# EAGLE design BMS (EAGLE 9.6.2)
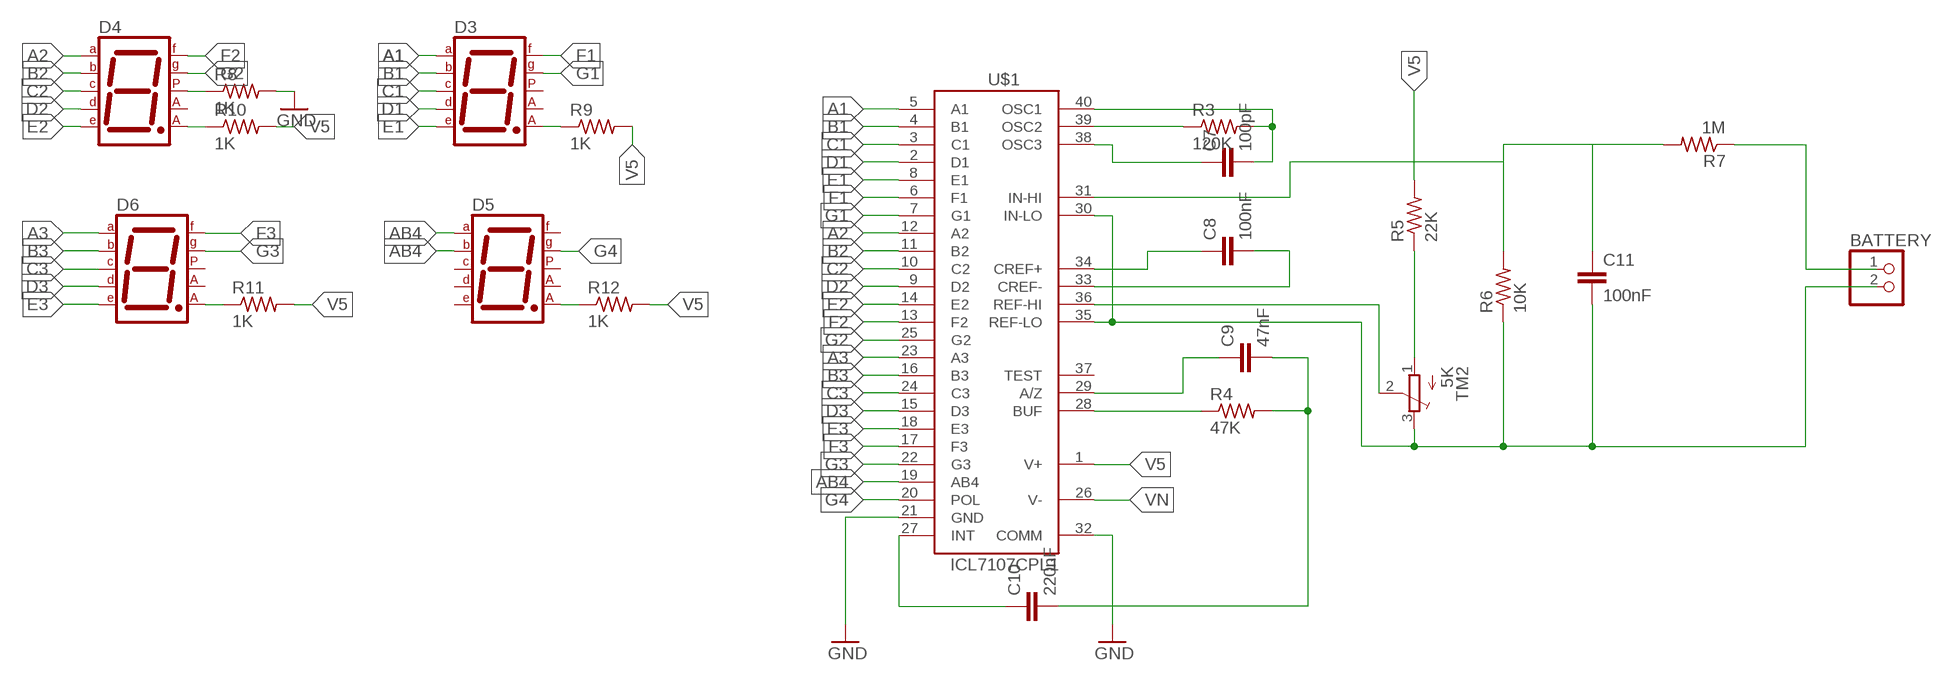
[diagram p0: schematic, sheet 1, part 1 of 2]
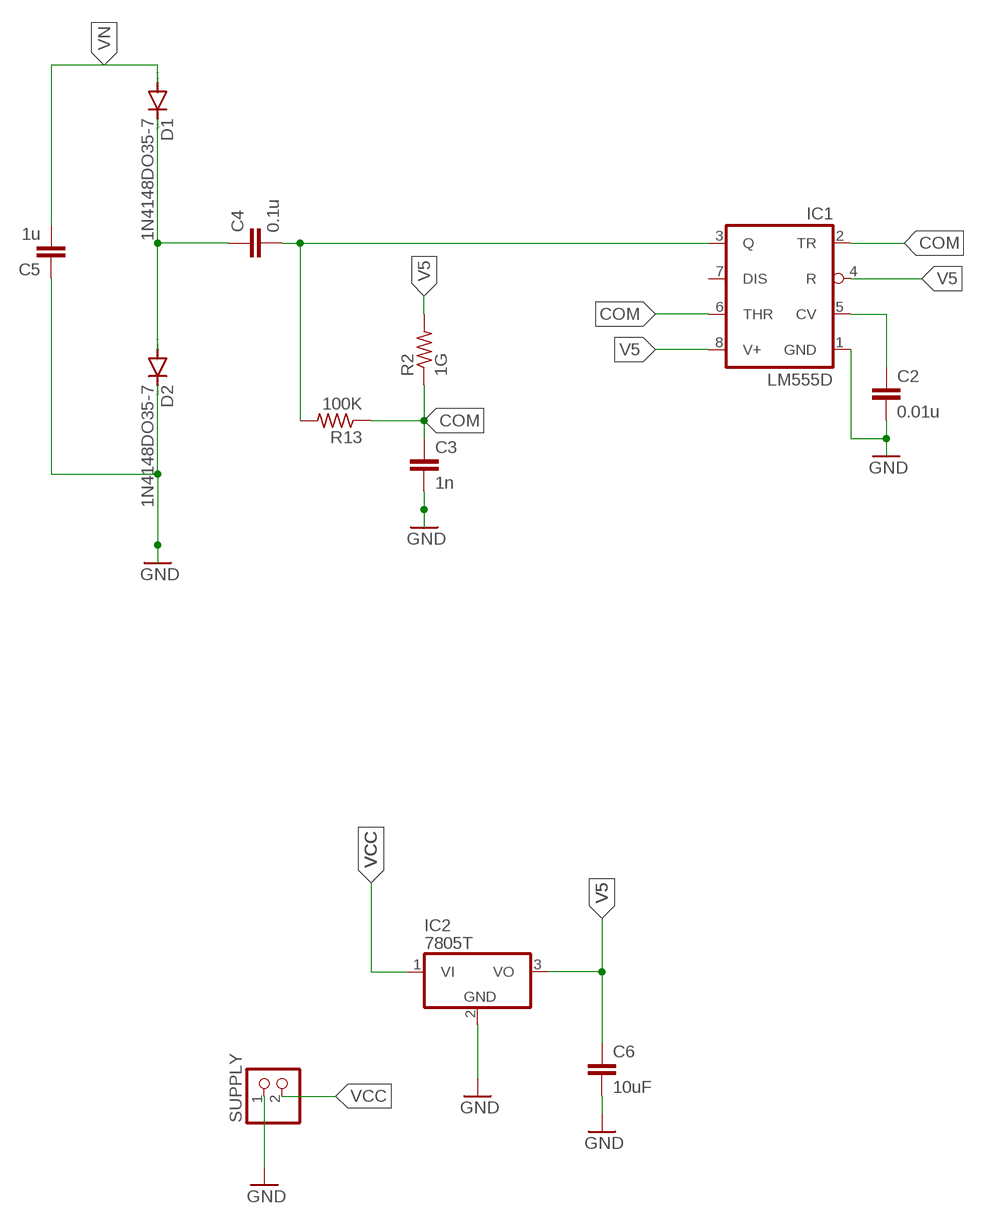
[diagram p1: schematic, sheet 1, part 2 of 2]

## Parts
BATTERY  PINHD-1X2  [1X02]
C2  0.01u  C-EU025-025X050  [C025-025X050]
C3  1n  C-EU025-025X050  [C025-025X050]
C4  0.1u  C-EU025-025X050  [C025-025X050]
C5  1u  C-EU025-025X050  [C025-025X050]
C6  10uF  C-EU025-025X050  [C025-025X050]
C7  100pF  C-EU025-025X050  [C025-025X050]
C8  100nF  C-EU025-025X050  [C025-025X050]
C9  47nF  C-EU025-025X050  [C025-025X050]
C10  220nF  C-EU025-025X050  [C025-025X050]
C11  100nF  C-EU025-025X050  [C025-025X050]
D1  1N4148DO35-7  [DO35-7]
D2  1N4148DO35-7  [DO35-7]
D3  7SEG-CA  [7SEG-13]
D4  7SEG-CA  [7SEG-13]
D5  7SEG-CA  [7SEG-13]
D6  7SEG-CA  [7SEG-13]
IC1  LM555D  [SO08]
IC2  7805T  [TO220H]
R2  1G  R-US_R0603  [R0603]
R3  120K  R-US_R0603  [R0603]
R4  47K  R-US_R0603  [R0603]
R5  22K  R-US_R0603  [R0603]
R6  10K  R-US_R0603  [R0603]
R7  1M  R-US_R0603  [R0603]
R8  1K  R-US_R0603  [R0603]
R9  1K  R-US_R0603  [R0603]
R10  1K  R-US_R0603  [R0603]
R11  1K  R-US_R0603  [R0603]
R12  1K  R-US_R0603  [R0603]
R13  100K  R-US_R0603  [R0603]
SUPPLY  PINHD-1X2  [1X02]
TM2  5K  TRIMPOTTC33X  [TC33X]
U$1  ICL7107CPL1  [DIL40]

## Nets
A1: D3.7(A) U$1.5(A1)
A2: D4.7(A) U$1.12(A2)
A3: D6.7(A) U$1.23(A3)
AB4: D5.6(B) D5.7(A) U$1.19(AB4)
B1: D3.6(B) U$1.4(B1)
B2: D4.6(B) U$1.11(B2)
B3: D6.6(B) U$1.16(B3)
C1: D3.4(C) U$1.3(C1)
C2: D4.4(C) U$1.10(C2)
C3: D6.4(C) U$1.24(C3)
COM: C3.1 IC1.2(TR) IC1.6(THR) R2.1 R13.1
D1: D3.2(D) U$1.2(D1)
D2: D4.2(D) U$1.9(D2)
D3: D6.2(D) U$1.15(D3)
E1: D3.1(E) U$1.8(E1)
E2: D4.1(E) U$1.14(E2)
E3: D6.1(E) U$1.18(E3)
F1: D3.9(F) U$1.6(F1)
F2: D4.9(F) U$1.13(F2)
F3: D6.9(F) U$1.17(F3)
G1: D3.10(G) U$1.7(G1)
G2: D4.10(G) U$1.25(G2)
G3: D6.10(G) U$1.22(G3)
G4: D5.10(G) U$1.20(POL)
GND: C2.2 C3.2 C5.1 C6.2 D2.C IC1.1(GND) IC2.2(GND) R8.2 SUPPLY.1 U$1.21(GND) U$1.32(COMM)
N$1: C2.1 IC1.5(CV)
N$2: D3.8(CA2) R9.1
N$3: C4.2 IC1.3(Q) R13.2
N$4: BATTERY.2 C11.2 R6.1 TM2.3(E) U$1.30(IN-LO) U$1.35(REF-LO)
N$5: C7.2 R3.2 U$1.40(OSC1)
N$6: C4.1 D1.C D2.A
N$7: R3.1 U$1.39(OSC2)
N$8: C7.1 U$1.38(OSC3)
N$9: C8.1 U$1.34(CREF+)
N$10: C8.2 U$1.33(CREF-)
N$11: C9.1 U$1.29(A/Z)
N$12: R4.1 U$1.28(BUF)
N$13: C9.2 C10.2 R4.2
N$14: C10.1 U$1.27(INT)
N$15: R5.1 TM2.1(A)
N$16: R6.2 R7.2 U$1.31(IN-HI)
N$17: D4.5(DP) R8.1
N$19: BATTERY.1 R7.1
N$20: TM2.2(S) U$1.36(REF-HI)
N$23: D6.8(CA2) R11.1
N$28: D4.8(CA2) R10.1
N$30: D5.8(CA2) R12.1
V5: C6.1 C11.1 IC1.4(R) IC1.8(V+) IC2.3(VO) R2.2 R5.2 R9.2 R10.2 R11.2 R12.2 U$1.1(V+)
VCC: IC2.1(VI) SUPPLY.2
VN: C5.2 D1.A U$1.26(V-)
Unconnected: D3.3(CA1) D3.5(DP) D4.3(CA1) D5.1(E) D5.2(D) D5.3(CA1) D5.4(C) D5.5(DP) D5.9(F) D6.3(CA1) D6.5(DP) IC1.7(DIS) U$1.37(TEST)

## Library data of the parts
BATTERY SUPPLY = pinhead:PINHD-1X2: PIN HEADER
C2-C11 = rcl:C-EU: CAPACITOR, European symbol; SPICEPREFIX: C
D1 D2 = diode:1N4148: DIODE high speed (Philips)
D3-D6 = special:7SEG-CA: 7-segment DISPLAY single anode, 13 mm
IC1 = linear:*555: TIMER
IC2 = adafruit:78*: Positive VOLTAGE REGULATOR Added bigger pads to the TO-92 package
R2-R13 = rcl:R-US_: RESISTOR, American symbol; SPICEPREFIX: R
TM2 = adafruit:TRIMPOT: SMT trimmer potentiometer part number TC33X http://www.ladyada.net/library/eagle
U$1 = maxim-3:ICL7107CPL: LED DRIVER

## Net classes
0 default: width 0.305 mm, drill 0.508 mm, clearance 0.254 mm

## Board
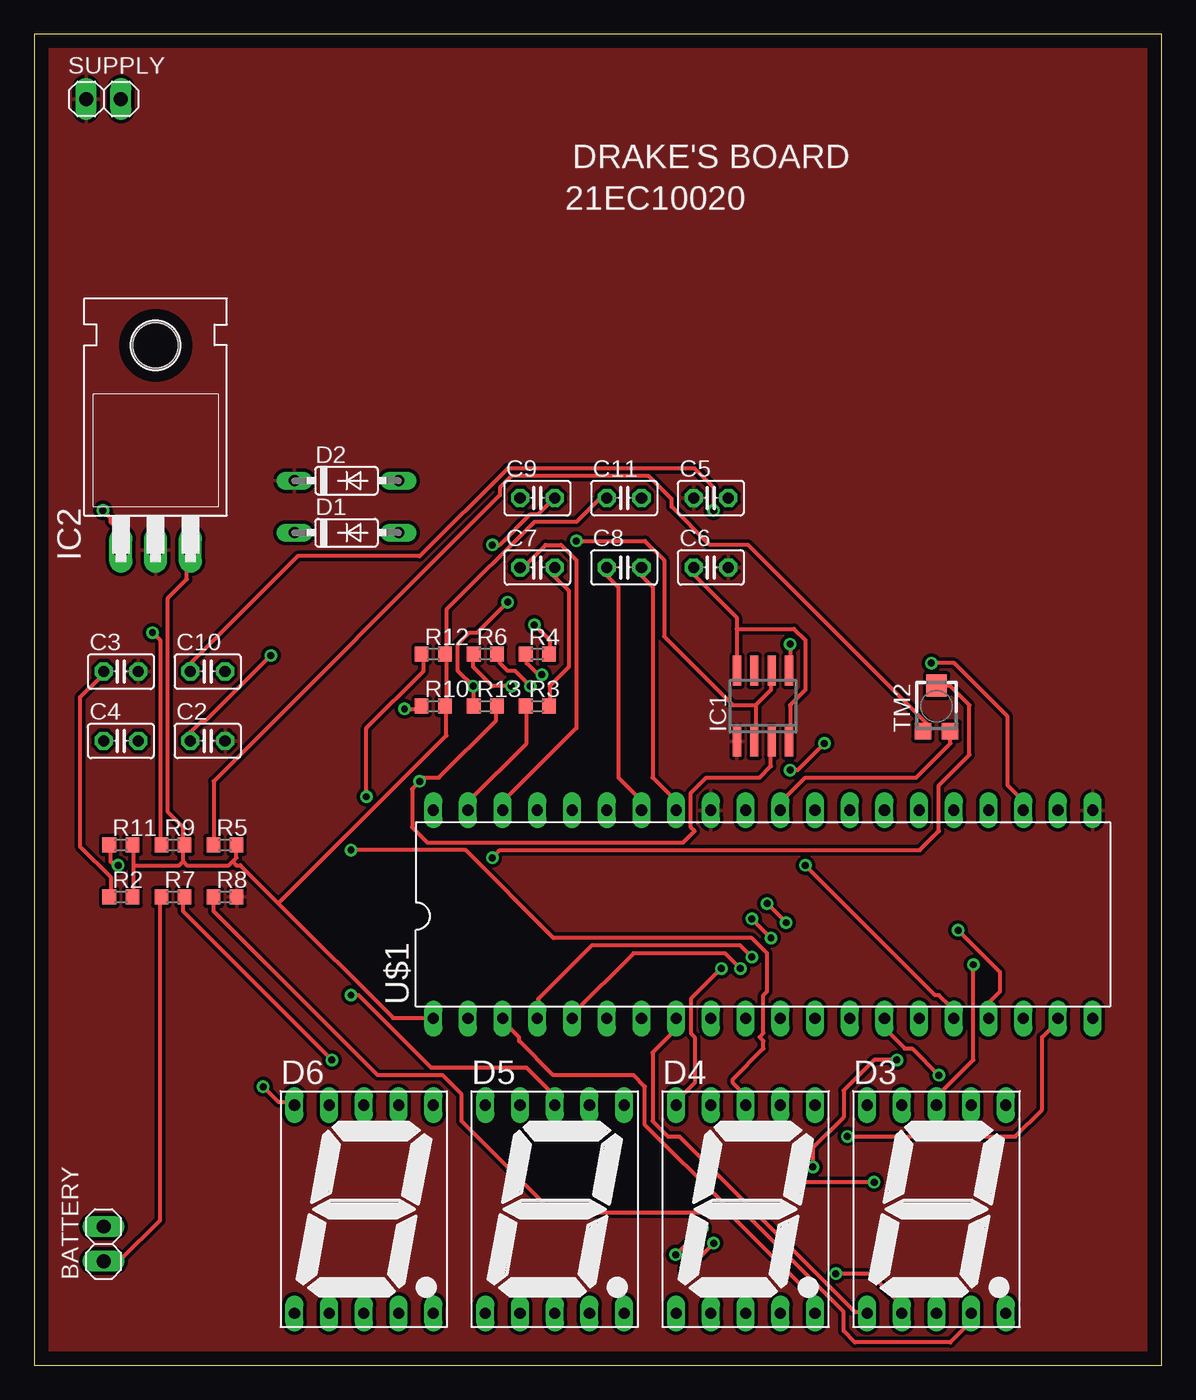
[diagram p2: board, top side]
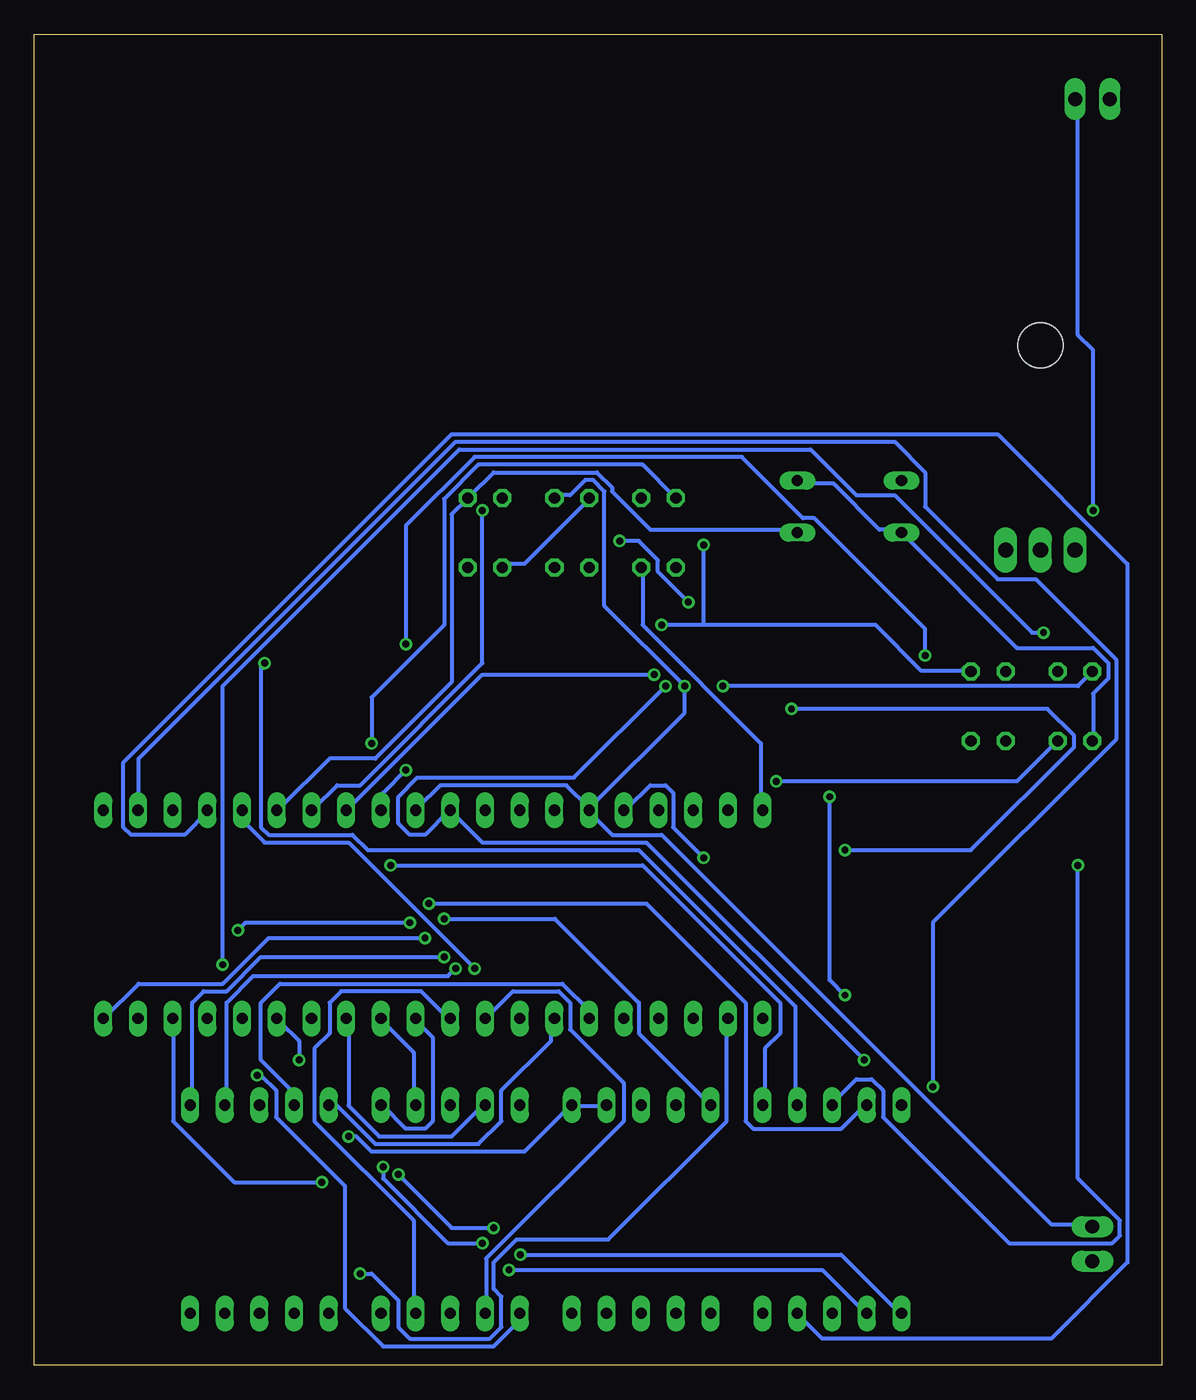
[diagram p3: board, bottom side, seen from below]

Size 82.53 x 97.46 mm. Coordinates in mm from the lower left corner, seen from the top.
Outline: 0,0 82.53,0 82.53,97.46 0,97.46 0,0
Copper layers (1*16): Top 0.035mm / dielectric 1.5mm / Bottom 0.035mm
Design rules "default": minimum track width 6mil, minimum drill 0.35mm, track to track 6mil, track to pad 6mil, pad to pad 6mil, via to via 6mil, smd to smd 6mil, copper to edge 40mil, drill to drill 6mil, minimum pad ring 10mil, minimum via ring 8mil, stop-mask expansion 4mil, vias tented up to drill 0mil, thermal gap 10mil

### Footprints (pad centres in the part's own frame; a part is rotated, then mirrored left to right if it is on the bottom)
1X02 = drill 1.016 long: 1 -1.27,0; 2 1.27,0
C025-025X050 = drill 0.813 octagon: 1 -1.27,0; 2 1.27,0
DO35-7 = drill 0.813 long: A 3.81,0; C -3.81,0
7SEG-13 = drill 0.813 long: 1 -5.08,-7.62; 2 -2.54,-7.62; 3 0,-7.62; 4 2.54,-7.62; 5 5.08,-7.62; 6 5.08,7.62; 7 2.54,7.62; 8 0,7.62; 9 -2.54,7.62; 10 -5.08,7.62
SO08 = smd 0.6 x 2.2: 1 -1.905,-2.6; 2 -0.635,-2.6; 3 0.635,-2.6; 4 1.905,-2.6; 5 1.905,2.6; 6 0.635,2.6; 7 -0.635,2.6; 8 -1.905,2.6
TO220H = drill 1.118 long: 1 -2.54,-10.16; 2 0,-10.16; 3 2.54,-10.16 | hole 3.302: 0,4.826
R0603 = smd 1 x 1.1: 1 -0.85,0; 2 0.85,0
TC33X = smd 1.2 x 1.2: 1 -1,-1.825; 3 1,-1.825 | smd 1.5 x 1.6: 2 0,1.5
DIL40 = drill 0.813 long: 1 -24.13,-7.62; 2 -21.59,-7.62; 3 -19.05,-7.62; 4 -16.51,-7.62; 5 -13.97,-7.62; 6 -11.43,-7.62; 7 -8.89,-7.62; 8 -6.35,-7.62; 9 -3.81,-7.62; 10 -1.27,-7.62; 11 1.27,-7.62; 12 3.81,-7.62; 13 6.35,-7.62; 14 8.89,-7.62; 15 11.43,-7.62; 16 13.97,-7.62; 17 16.51,-7.62; 18 19.05,-7.62; 19 21.59,-7.62; 20 24.13,-7.62; 21 24.13,7.62; 22 21.59,7.62; 23 19.05,7.62; 24 16.51,7.62; 25 13.97,7.62; 26 11.43,7.62; 27 8.89,7.62; 28 6.35,7.62; 29 3.81,7.62; 30 1.27,7.62; 31 -1.27,7.62; 32 -3.81,7.62; 33 -6.35,7.62; 34 -8.89,7.62; 35 -11.43,7.62; 36 -13.97,7.62; 37 -16.51,7.62; 38 -19.05,7.62; 39 -21.59,7.62; 40 -24.13,7.62

### Placement (x,y rotation side)
BATTERY  5.08,8.89 90 top
C2  12.7,45.72 0 top
C3  6.35,50.8 0 top
C4  6.35,45.72 0 top
C5  49.53,63.5 0 top
C6  49.53,58.42 0 top
C7  36.83,58.42 0 top
C8  43.18,58.42 0 top
C9  36.83,63.5 0 top
C10  12.7,50.8 0 top
C11  43.18,63.5 0 top
D1  22.86,60.96 0 top
D2  22.86,64.77 0 top
D3  66.04,11.43 0 top
D4  52.07,11.43 0 top
D5  38.1,11.43 0 top
D6  24.13,11.43 0 top
IC1  53.34,48.26 0 top
IC2  8.89,69.85 0 top
R2  6.35,34.29 0 top
R3  36.83,48.26 0 top
R4  36.83,52.07 0 top
R5  13.97,38.1 0 top
R6  33.02,52.07 0 top
R7  10.16,34.29 0 top
R8  13.97,34.29 0 top
R9  10.16,38.1 0 top
R10  29.21,48.26 0 top
R11  6.35,38.1 0 top
R12  29.21,52.07 0 top
R13  33.02,48.26 0 top
SUPPLY  5.08,92.71 0 top
TM2  66.04,48.26 0 top
U$1  53.34,33.02 0 top

### Tracks (layer width: path | path; a pad name or v marks a point on that pad's centre or on a via)
A1  (via drill 0.51)
  Top 0.305: v51.69,29.06 50.57,30.18 43.87,30.18 39.4,25.7 39.4,25.43 U$1.5
  Bottom 0.305: v51.69,29.06 52.25,28.5 66.5,28.5 68.45,26.54 68.45,19.28 D3.7
A2
  Bottom 0.305: D4.7 54.76,19.28 54.76,22.91 57,25.15 U$1.12
A3  (via drill 0.51)
  Top 0.305: v65.66,51.41 67.33,51.41 71.25,47.5 71.25,42.47 72.36,41.35 72.36,40.79 U$1.23
  Bottom 0.305: v65.66,51.41 65.94,51.13 65.94,39.4 65.38,38.84 59.23,38.84 58.12,37.72 38.28,37.72 26.82,26.26 26.82,19.28 D6.7
AB4  (via drill 0.51)
  Top 0.305: v59.51,16.76 71.81,16.76 73.76,18.72 73.76,24.03 74.88,25.15 U$1.19
  Bottom 0.305: D5.7 40.79,19 43.03,19 D5.6 43.31,19 46.66,15.65 57.84,15.65 58.95,16.76 v59.51,16.76
B1  (via drill 0.51)
  Top 0.305: v52.53,29.9 51.69,30.73 40.79,30.73 36.88,26.82 36.88,25.43 U$1.4
  Bottom 0.305: v52.53,29.9 65.94,29.9 68.45,27.38 70.13,27.38 70.97,26.54 70.97,19.28 D3.6
B2
  Bottom 0.305: D4.6 57,19 55.32,17.32 53.92,17.32 53.37,17.88 53.37,24.03 54.48,25.15 U$1.11
B3  (via drill 0.51)
  Top 0.305: v56.44,36.6 65.94,27.1 66.22,27.1 67.06,26.26 67.06,25.43 U$1.16
  Bottom 0.305: v56.44,36.6 38,36.6 27.94,26.54 27.94,24.31 29.06,23.19 29.06,19.28 D6.6
C1
  Top 0.305: U$1.3 34.37,25.15 35.48,24.03 35.48,23.75 38,21.23 43.87,21.23 44.7,20.4 44.7,17.6 50.57,11.73 51.41,11.73 59.23,3.91 59.23,2.52 60.07,1.68 67.06,1.68 68.45,3.07 68.45,3.63 D3.4
C2
  Bottom 0.305: D4.4 54.76,3.91 54.76,10.62 62.03,17.88 62.03,23.19 60.91,24.31 60.91,26.54 60.07,27.38 54.2,27.38 52.25,25.43 U$1.10
C3
  Bottom 0.305: D6.4 26.54,3.63 24.87,1.96 8.1,1.96 2.52,7.54 2.52,58.67 12.01,68.17 51.97,68.17 76,44.15 76,39.4 75.44,38.84 71.53,38.84 69.85,40.51 U$1.24
COM  (via drill 0.51)
  Top 0.305: 52.81,48.34 52.81,45.82 IC1.2 | 52.81,48.34 53.92,49.45 53.92,50.85 IC1.6 | R2.1 5.59,34.37 5.59,35.76 3.35,38 3.35,48.9 4.75,50.29 4.75,50.57 5.03,50.85 C3.1 | R13.1 32.13,48.34 v32.13,49.73 31.01,50.85 31.01,52.81 31.85,53.65 32.41,53.65 v34.65,55.88 | 52.81,48.34 51.13,48.34 46.1,53.37 46.1,58.95 44.7,60.35 v39.67,60.35
  Bottom 0.305: v32.13,49.73 6.15,49.73 C3.1 | v39.67,60.35 38.28,60.35 36.88,58.95 36.88,58.12 v34.65,55.88
D1  (via drill 0.51)
  Top 0.305: v58.67,6.71 61.19,6.71 63.42,4.47 63.42,3.91 D3.2
  Bottom 0.305: v58.67,6.71 57.84,6.71 55.88,4.75 55.88,2.79 55.04,1.96 49.17,1.96 48.34,2.79 48.34,5.03 48.9,5.59 48.9,7.54 47.22,9.22 40.51,9.22 31.85,17.88 31.85,25.15 U$1.2
D2
  Bottom 0.305: D4.2 49.45,3.91 49.45,7.82 39.4,17.88 39.4,20.68 43.31,24.59 43.31,26.54 44.15,27.38 47.5,27.38 49.45,25.43 U$1.9
D3  (via drill 0.51)
  Top 0.305: v49.73,8.94 v47.78,6.99 | v57,14.53 57,15.93 59.23,18.16 59.23,20.12 61.47,22.35 v63.14,22.35
  Bottom 0.305: v47.78,6.99 24.87,6.99 21.79,3.91 D6.2 | v49.73,8.94 52.25,8.94 57,13.69 v57,14.53 | v63.14,22.35 63.14,23.75 64.54,25.15 U$1.15
E1
  Top 0.305: D3.1 60.91,3.91 60.07,3.91 47.22,16.76 46.38,16.76 45.26,17.88 45.26,22.91 46.94,24.59 46.94,25.15 U$1.8
E2  (via drill 0.51)
  Top 0.305: v66.22,21.23 64.26,23.19 63.7,23.19 62.31,24.59 62.31,25.15 U$1.14
  Bottom 0.305: v66.22,21.23 65.94,21.23 64.82,20.12 64.82,18.16 59.79,13.13 59.79,4.19 57,1.4 48.9,1.4 47.22,3.07 47.22,3.63 D4.1
E3  (via drill 0.51)
  Top 0.305: v48.9,10.06 v46.94,8.1 | v55.88,13.97 56.44,13.41 v61.47,13.41
  Bottom 0.305: v46.94,8.1 23.47,8.1 19.28,3.91 D6.1 | v48.9,10.06 51.97,10.06 v55.88,13.97 | v61.47,13.41 67.89,13.41 72.36,17.88 72.36,25.15 U$1.18
F1
  Bottom 0.305: U$1.6 41.91,25.98 43.87,27.94 64.54,27.94 65.94,26.54 65.94,22.35 63.7,20.12 63.7,19.28 D3.9
F2
  Bottom 0.305: D4.9 49.73,19 51.97,16.76 57.28,16.76 59.51,19 59.51,25.15 U$1.13
F3  (via drill 0.51)
  Top 0.305: v55.04,32.41 v53.65,33.81 | v67.61,31.85 70.69,28.78 70.69,27.38 69.85,26.54 U$1.17
  Bottom 0.305: v53.65,33.81 37.72,33.81 30.45,26.54 30.45,17.88 29.9,17.32 23.47,17.32 21.79,19 D6.9 | v55.04,32.41 67.06,32.41 v67.61,31.85
G1
  Bottom 0.305: U$1.7 44.7,25.15 44.7,23.75 48.34,20.12 48.34,17.88 50.01,16.2 57.56,16.2 60.35,19 60.91,19 D3.10
G2  (via drill 0.51)
  Top 0.305: v50.29,29.06 48.06,26.82 48.06,24.31 48.34,24.03 48.34,20.68 47.22,19.56 47.22,19.28 D4.10
  Bottom 0.305: v50.29,29.06 59.51,38.28 65.66,38.28 67.06,39.67 67.06,40.51 U$1.25
G3  (via drill 0.51)
  Top 0.305: v16.76,20.4 17.88,19.28 19,19.28 D6.10
  Bottom 0.305: v16.76,20.4 16.76,32.41 3.35,45.82 3.35,51.69 9.22,57.56 12.01,57.56 17.32,62.87 17.32,65.38 19.56,67.61 51.69,67.61 74.88,44.42 74.88,40.79 U$1.22
G4  (via drill 0.51)
  Top 0.305: v53.92,31.29 v52.53,32.69
  Bottom 0.305: D5.10 38.28,24.31 38.28,26.54 44.42,32.69 v52.53,32.69 | v53.92,31.29 65.38,31.29 68.73,27.94 74.88,27.94 77.39,25.43 U$1.20
GND
  pour Top: -1.27,99.06 83.82,99.06 83.82,-1.27 -1.27,-1.27
N$1  (via drill 0.51)
  Top 0.305: v55.32,52.81 55.32,51.13 IC1.5 | v17.32,51.97 12.57,47.22 12.29,47.22 11.46,46.38 11.46,45.82 C2.1
  Bottom 0.305: v55.32,52.81 55.32,61.47 50.29,66.5 30.73,66.5 26.26,62.03 25.43,62.03 17.32,53.92 v17.32,51.97
N$2  (via drill 0.51)
  Top 0.305: v8.66,53.65 9.22,53.09 9.22,38.28 R9.1 | v68.73,29.34 68.73,22.35 66.22,19.84 66.22,19.28 D3.8
  Bottom 0.305: v8.66,53.65 9.5,53.65 19.56,63.7 22.35,63.7 25.7,67.06 51.41,67.06 68.73,49.73 v68.73,29.34
N$3  (via drill 0.51)
  Top 0.305: R13.2 33.81,48.06 33.81,47.22 29.62,43.03 28.5,43.03 v28.22,42.75 27.66,42.19 27.66,39.4 28.78,38.28 47.5,38.28 48.34,39.12 48.06,39.4 48.06,41.91 49.17,43.03 53.09,43.03 53.92,43.87 53.92,45.54 IC1.3
  Bottom 0.305: v28.22,42.75 10.62,42.75 7.82,45.54 C4.2
N$4  (via drill 0.51)
  Top 0.305: TM2.3 67.06,46.38 67.06,45.54 64.54,43.03 56.44,43.03 54.76,41.35 54.76,40.79 U$1.30 | v34.92,49.73 33.53,49.73 32.13,51.13 32.13,51.97 R6.1
  Bottom 0.305: 41.91,40.79 34.92,47.78 v34.92,49.73 40.79,55.6 40.79,63.98 41.63,64.82 42.19,64.82 43.31,63.7 44.42,63.7 C11.2 | BATTERY.2 5.31,10.34 8.1,10.34 36.6,38.84 40.23,38.84 41.91,40.51 U$1.35 41.91,40.79 | 41.91,40.79 43.59,42.47 52.81,42.47 54.48,40.79 U$1.30
N$5
  Top 0.305: R3.2 37.72,48.34 37.72,49.73 39.12,51.13 39.12,56.72 38,57.84 38,58.4 C7.2
  Bottom 0.305: U$1.40 29.34,40.79 29.34,45.54 38,54.2 38,58.4 C7.2
N$6
  Bottom 0.305: C4.1 5.03,45.82 5.03,49.17 3.91,50.29 3.91,51.41 5.03,52.53 10.62,52.53 D1.C 19.28,61.19 20.68,61.19 24.03,64.54 26.54,64.54 D2.A
N$7
  Top 0.305: R3.1 36.04,48.06 36.04,45.54 31.85,41.35 31.85,40.79 U$1.39
N$8
  Top 0.305: U$1.38 34.37,40.79 34.37,41.35 39.67,46.66 39.67,58.95 38.56,60.07 37.44,60.07 36.04,58.67 36.04,58.4 35.76,58.4 C7.1
N$9
  Top 0.305: C8.1 41.91,57.84 42.75,57 42.75,43.03 44.42,41.35 44.42,40.79 U$1.34
N$10
  Top 0.305: U$1.33 46.94,40.79 46.94,41.35 45.26,43.03 45.26,57 44.42,57.84 44.42,58.4 C8.2
N$11  (via drill 0.51)
  Top 0.305: v55.32,43.59 55.88,43.59 v57.84,45.54
  Bottom 0.305: v55.32,43.59 57,41.91 57,40.79 U$1.29 | v57.84,45.54 57.84,48.9 52.53,54.2 52.53,63.42 50.01,65.94 38,65.94 C9.1
N$12  (via drill 0.51)
  Top 0.305: v37.16,50.57 36.88,50.57 36.04,51.41 36.04,51.97 R4.1
  Bottom 0.305: v37.16,50.57 49.73,50.57 59.51,40.79 U$1.28
N$13  (via drill 0.51)
  Top 0.305: v36.6,54.2 37.72,53.09 37.72,52.25 R4.2 | v33.53,60.07 34.09,60.07 36.32,62.31 36.88,62.31 38,63.42 C9.2
  Bottom 0.305: 33.53,54.2 20.95,54.2 17.6,50.85 13.97,50.85 C10.2 | 33.53,54.2 v36.6,54.2 | 33.53,54.2 v33.53,60.07
N$14  (via drill 0.51)
  Top 0.305: v49.73,62.59 49.73,64.26 48.34,65.66 34.65,65.66 28.22,59.23 19.28,59.23 11.46,51.41 11.46,50.85 C10.1
  Bottom 0.305: v49.73,62.59 49.73,51.41 58.67,42.47 60.35,42.47 62.03,40.79 U$1.27
N$15
  Top 0.305: R5.1 13.13,38.28 13.13,42.75 34.09,63.7 34.09,64.26 34.92,65.1 44.98,65.1 46.66,63.42 46.66,62.87 49.45,60.07 52.25,60.07 65.38,46.94 65.38,46.66 65.1,46.38 TM2.1
N$16  (via drill 0.51)
  Top 0.305: v21.79,22.35 10.9,33.25 10.9,34.09 R7.2 | v36.32,49.73 35.2,50.85 34.65,50.85 34.09,51.41 34.09,51.97 R6.2
  Bottom 0.305: v21.79,22.35 37.72,38.28 49.73,38.28 51.97,40.51 U$1.31 52.25,40.51 53.92,38.84 55.04,38.84 55.88,39.67 55.88,41.63 54.48,43.03 43.03,43.03 v36.32,49.73
N$17
  Top 0.305: R8.1 13.13,34.09 13.13,33.25 25.15,21.23 29.9,21.23 31.29,19.84 31.29,17.88 38,11.18 50.85,11.18 57,5.03 57,3.91 D4.5
N$19
  Top 0.305: R7.1 9.22,34.09 9.22,10.62 6.43,7.82 5.31,7.82 BATTERY.1
N$20  (via drill 0.51)
  Top 0.305: v33.53,37.16 34.09,37.72 64.82,37.72 66.22,39.12 66.22,42.47 68.45,44.7 68.45,48.34 67.06,49.73 66.22,49.73 TM2.2
  Bottom 0.305: v33.53,37.16 35.76,39.4 35.76,41.91 36.32,42.47 37.44,42.47 39.12,40.79 U$1.36
N$23  (via drill 0.51)
  Top 0.305: v6.15,36.6 5.87,36.6 5.59,36.88 5.59,38 R11.1
  Bottom 0.305: v6.15,36.6 6.15,13.69 3.07,10.62 3.07,9.5 3.63,8.94 11.18,8.94 20.4,18.16 20.4,20.12 21.23,20.95 22.35,20.95 24.03,19.28 D6.8
N$28  (via drill 0.51)
  Top 0.305: v27.1,48.06 28.22,48.06 R10.1 | v23.19,37.72 31.57,37.72 38,31.29 52.53,31.29 53.65,30.18 53.65,27.38 53.37,27.1 53.37,24.31 53.09,24.03 53.37,23.75 53.37,23.19 51.13,20.95 51.13,20.68 51.97,19.84 51.97,19.28 D4.8
  Bottom 0.305: v27.1,48.06 8.38,48.06 6.43,46.1 6.43,45.26 13.97,37.72 v23.19,37.72
N$30  (via drill 0.51)
  Top 0.305: v24.31,41.63 24.31,46.66 28.5,50.85 28.5,51.97 R12.1 | v23.19,27.1 23.75,27.1 29.06,21.79 36.04,21.79 38,19.84 38,19.28 D5.8
  Bottom 0.305: v24.31,41.63 24.31,28.22 v23.19,27.1
V5
  Top 0.305: 51.41,53.92 51.41,54.76 48.34,57.84 48.34,58.4 C6.1 | 51.41,53.92 51.41,51.13 IC1.8 | 51.41,53.92 55.6,53.92 56.44,53.09 56.44,49.45 55.32,48.34 55.32,45.82 IC1.4 | C11.1 41.91,63.42 41.35,63.42 39.67,61.75 36.6,61.75 30.18,55.32 30.18,52.25 R12.2 30.18,51.97 30.18,48.34 R10.2 30.18,48.06 30.18,46.1 17.88,33.81 | 7.26,36.6 7.26,38 R11.2 | 7.26,36.6 7.26,34.37 R2.2 | 10.9,36.88 10.9,38 R9.2 10.9,38.28 10.9,39.4 9.78,40.51 9.78,56.16 11.18,57.56 11.18,59.51 IC2.3 | 10.9,36.88 10.62,36.6 7.26,36.6 | 14.53,36.88 14.25,36.6 11.18,36.6 10.9,36.88 | 14.53,36.88 14.81,37.16 14.81,38 R5.2 | 17.88,33.81 15.09,36.6 14.81,36.6 14.53,36.88 | 17.88,33.81 26.26,25.43 29.06,25.43 U$1.1
  Bottom 0.305: C6.1 48.06,58.67 46.66,58.67 41.91,63.42 C11.1
VCC  (via drill 0.51)
  Top 0.305: v5.03,62.59 5.59,62.03 5.59,61.75 6.15,61.19 6.15,59.79 IC2.1
  Bottom 0.305: v5.03,62.59 5.03,74.32 6.15,75.44 6.15,92.48 SUPPLY.2
VN
  Bottom 0.305: D1.A 26.82,61.19 37.44,61.19 40.23,63.98 40.23,64.26 41.35,65.38 48.9,65.38 50.57,63.7 C5.2 50.85,63.42 51.97,62.31 51.97,50.01 57.56,44.42 60.91,44.42 64.54,40.79 U$1.26

### Text on the board
tPlace: DRAKE'S BOARD | 21EC10020